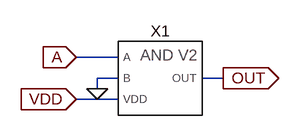
[diagram p0: schematic CLEAR_V2.asc]
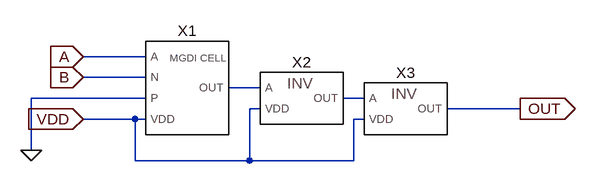
[diagram p1: sub-circuit and_v2.asc]
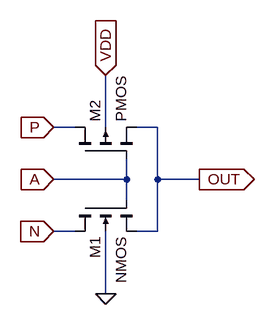
[diagram p2: sub-circuit gdicell.asc]
CLEAR_V2.asc, the LTspice schematic file:
Version 4
SHEET 1 880 680
WIRE 160 128 96 128
WIRE 160 160 128 160
WIRE 320 160 288 160
WIRE 128 176 128 160
WIRE 160 192 96 192
FLAG 128 176 0
FLAG 96 128 A
IOPIN 96 128 In
FLAG 96 192 VDD
IOPIN 96 192 In
FLAG 320 160 OUT
IOPIN 320 160 Out
SYMBOL AND_V2 224 160 R0
SYMATTR InstName X1

and_v2.asc, the sub-circuit schematic file:
Version 4
SHEET 1 880 680
WIRE -32 192 -128 192
WIRE -32 224 -128 224
WIRE 144 240 96 240
WIRE -32 256 -208 256
WIRE 304 256 272 256
WIRE 144 272 128 272
WIRE 544 272 432 272
WIRE -48 288 -128 288
WIRE -32 288 -48 288
WIRE 304 288 288 288
WIRE -208 336 -208 256
WIRE -48 352 -48 288
WIRE 128 352 128 272
WIRE 128 352 -48 352
WIRE 288 352 288 288
WIRE 288 352 128 352
FLAG -128 192 A
IOPIN -128 192 In
FLAG -128 224 B
IOPIN -128 224 In
FLAG -128 288 VDD
IOPIN -128 288 In
FLAG 544 272 OUT
IOPIN 544 272 Out
FLAG -208 336 0
SYMBOL GDICell 32 240 R0
SYMATTR InstName X1
SYMBOL INVgdi 208 256 R0
SYMATTR InstName X2
SYMBOL INVgdi 368 272 R0
SYMATTR InstName X3

gdicell.asc, the sub-circuit schematic file:
Version 4
SHEET 1 1484 2272
WIRE 176 96 144 96
WIRE 224 96 224 16
WIRE 304 96 272 96
WIRE 256 176 256 144
WIRE 256 176 144 176
WIRE 304 176 304 96
WIRE 368 176 304 176
WIRE 256 208 256 176
WIRE 176 256 144 256
WIRE 304 256 304 176
WIRE 304 256 272 256
WIRE 224 352 224 256
FLAG 144 96 P
IOPIN 144 96 In
FLAG 144 256 N
IOPIN 144 256 In
FLAG 144 176 A
IOPIN 144 176 In
FLAG 368 176 OUT
IOPIN 368 176 Out
FLAG 224 16 VDD
IOPIN 224 16 In
FLAG 224 352 0
SYMBOL nmos4 176 208 M90
SYMATTR InstName M1
SYMATTR Value2 l=65nm w=65nm
SYMBOL pmos4 176 144 R270
SYMATTR InstName M2
SYMATTR Value2 l=65nm w=162.5nm

The netlist it stands for:
* CLEAR_V2.asc
XX1 A 0 VDD OUT and_v2

* block symbol definitions
.subckt and_v2 A B VDD OUT
XX1 A B 0 VDD N001 gdicell
XX2 N001 VDD N002 INVgdi  ; pins A VDD OUT
XX3 N002 VDD OUT INVgdi  ; pins A VDD OUT
.ends and_v2

.subckt gdicell A N P VDD OUT
M1 N A OUT 0 NMOS l=65nm w=65nm
M2 P A OUT VDD PMOS l=65nm w=162.5nm
.ends gdicell

.model NMOS NMOS
.model PMOS PMOS
.lib standard.mos
.backanno
.end